# EAGLE schematic servoUART by Aruduino (EAGLE 8.2.2)
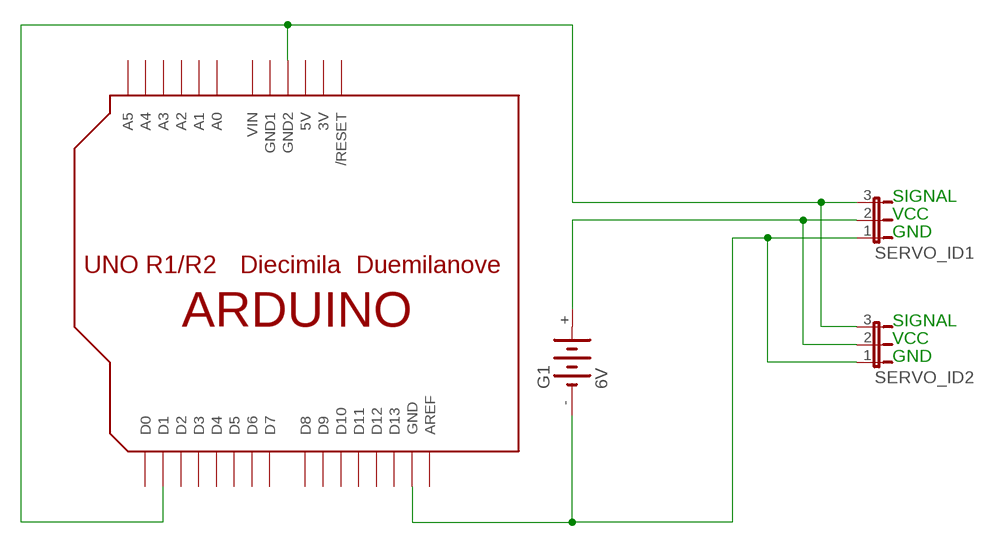
[diagram p0: schematic, sheet 1]

## Parts
G1  6V  3V11R  [3V11R]
SERVO_ID1  JP2E  [JP2]
SERVO_ID2  JP2E  [JP2]
U$1  ARDUINOUNO  [ARDUINO]

## Nets
N$3: G1.- SERVO_ID1.1 SERVO_ID2.1 U$1.GND
N$4: G1.+ SERVO_ID1.2 SERVO_ID2.2
N$6: SERVO_ID1.3 SERVO_ID2.3 U$1.D1 U$1.GND2
Unconnected: U$1.A0 U$1.A1 U$1.A2 U$1.A3 U$1.A4 U$1.A5 U$1.AREF U$1.D0 U$1.D2 U$1.D3 U$1.D4 U$1.D5 U$1.D6 U$1.D7 U$1.D8 U$1.D9 U$1.D10 U$1.D11 U$1.D12 U$1.D13 U$1.RESET(/RESET)

## Notes on the sheet
- SIGNAL
- VCC
- GND
- SIGNAL
- VCC
- GND

## Power pins joined to a net without a drawn wire
3V: U$1.3V
5V: U$1.5V
GND1: U$1.GND1
VIN: U$1.VIN

## Library data of the parts
G1 = battery:3V11R: NC ACCU Varta
SERVO_ID1 SERVO_ID2 = jumper:JP2E: JUMPER
U$1 = arduino:ARDUINO: Arduino Diecimila/Duemilanove Make a shield with ease, this package has all the named pins as well as the two mounting drill holes and an outline of the USB and DC power connector. The outline is on the DIMENSION layer, so if your board house uses it they will cut the outline to match. http://www.ladyada.net/library/pcb/eaglelibrary.html